# EAGLE design PCB_LTC6752 (EAGLE 9.1.2)
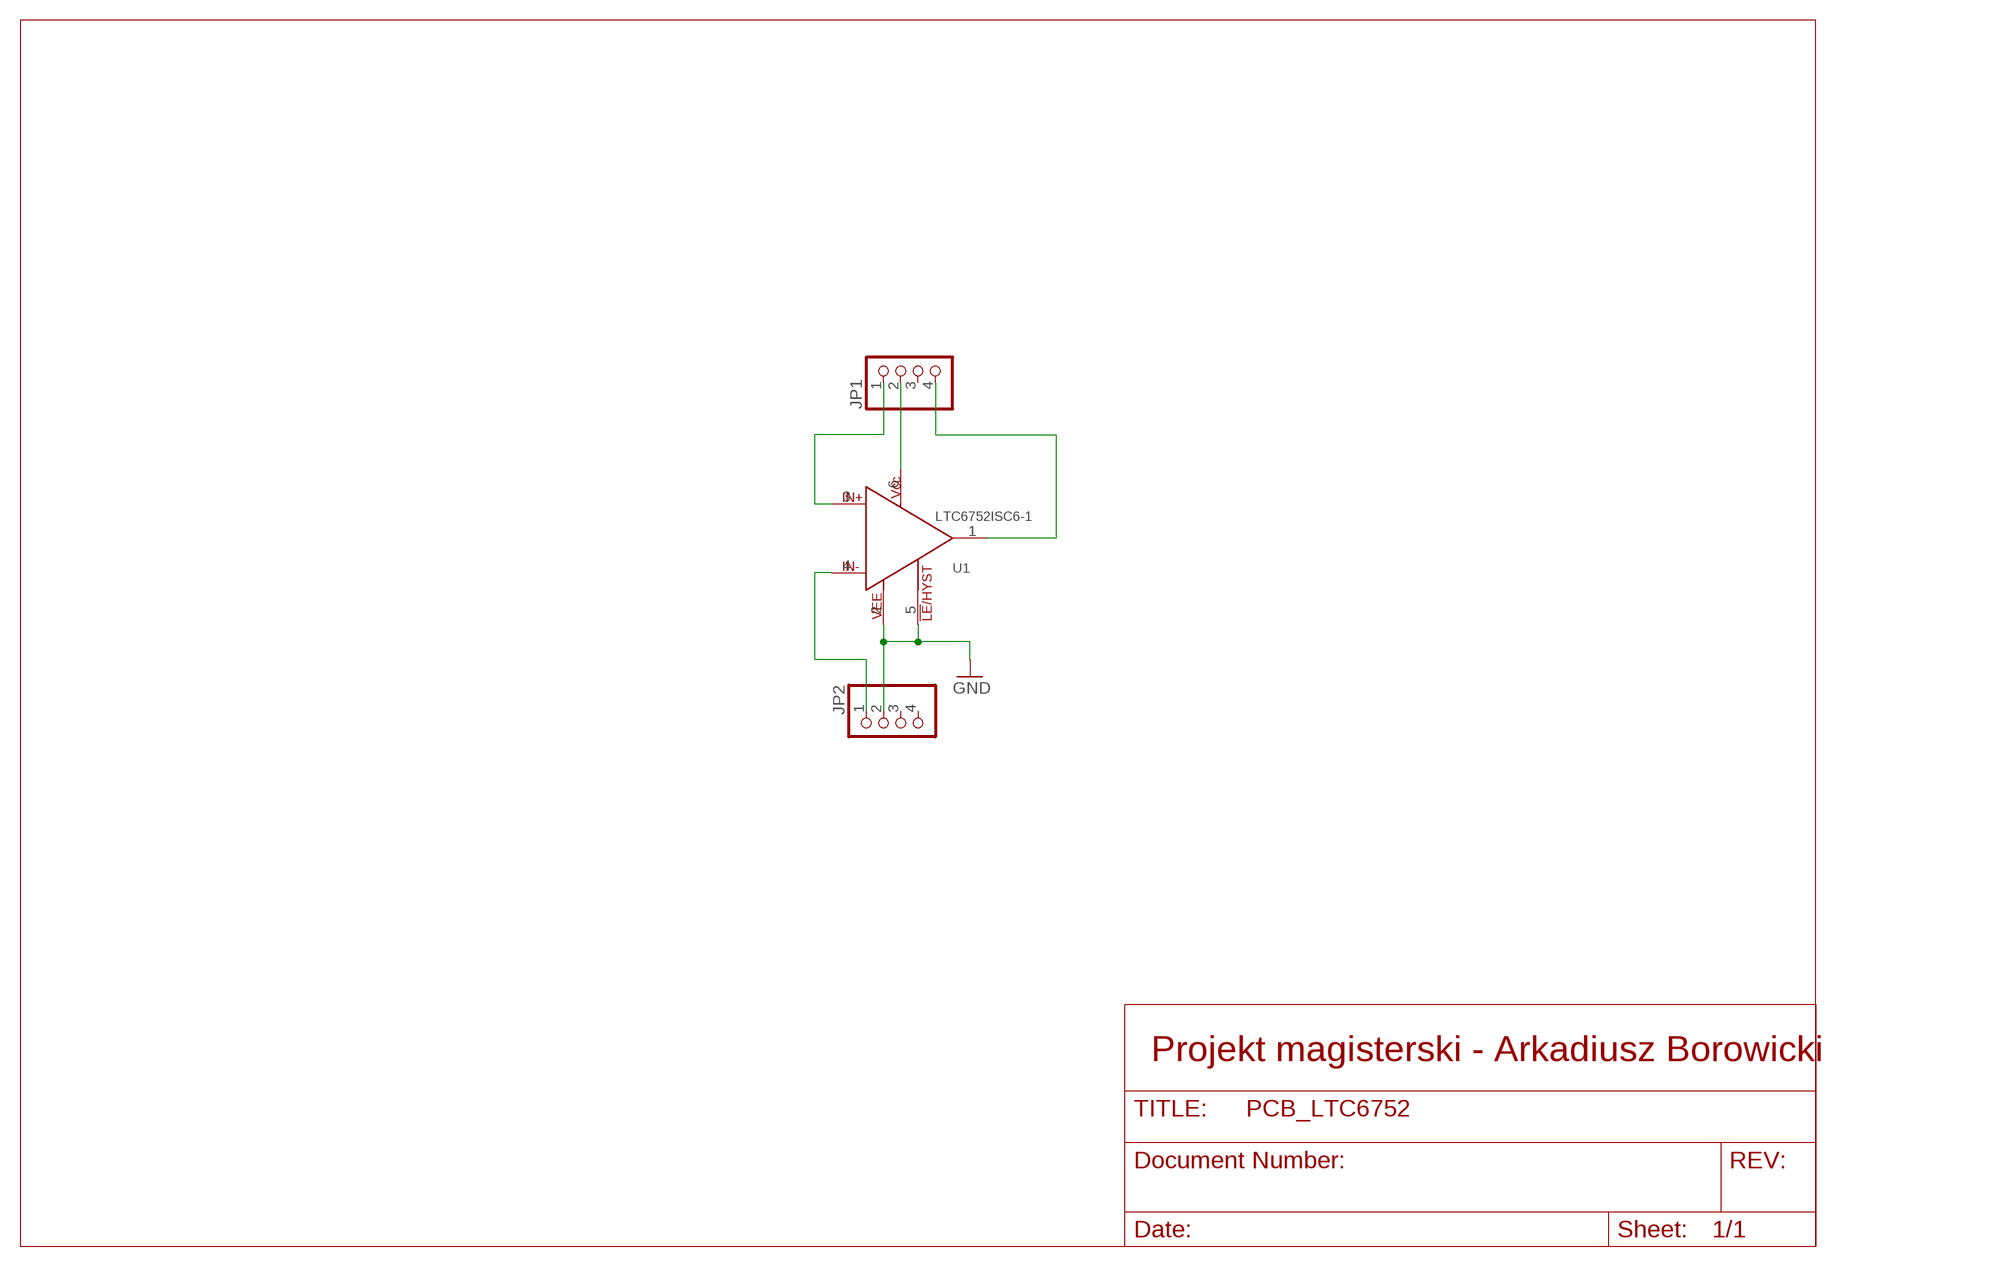
[diagram p0: schematic, sheet 1]

## Parts
JP1  PINHD-1X4  [1X04]
JP2  PINHD-1X4  [1X04]
U1  LTC6752ISC6-1  [SC70-6]

## Nets
GND: JP2.2 U1.2(VEE) U1.5(HYST)
N$1: JP1.2 U1.6(VCC)
N$2: JP1.1 U1.3(IN+)
N$3: JP2.1 U1.4(IN-)
N$5: JP1.4 U1.1(OUT)
Unconnected: JP1.3 JP2.3 JP2.4

## Notes on the sheet
- Projekt magisterski - Arkadiusz Borowicki

## Library data of the parts
JP1 JP2 = pinhead:PINHD-1X4: PIN HEADER
U1 = LTC6752ISC6-1:LTC6752ISC6-1: Check availability <https://pricing.snapeda.com/parts/LTC6752ISC6-1/Analog%20Devices%20Inc./view-part?ref=eda>; AVAILABILITY: In Stock; CHECK_PRICES: https://www.snapeda.com/parts/LTC6752ISC6-1/Analog+Devices/view-part/?ref=eda; DESCRIPTION: Comparator Single R-R I/P 3.5V 6-Pin SC-70 T/R; MF: Analog Devices Inc.; MP: LTC6752ISC6-1; PACKAGE: None; PRICE: None; SNAPEDA_LINK: https://www.snapeda.com/parts/LTC6752ISC6-1/Analog+Devices/view-part/?ref=snap

## Board
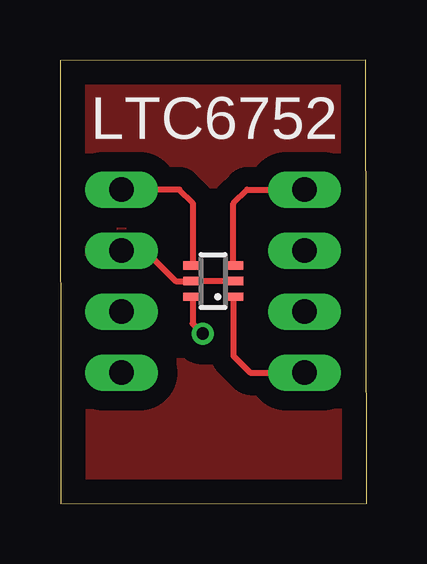
[diagram p1: board, top side]
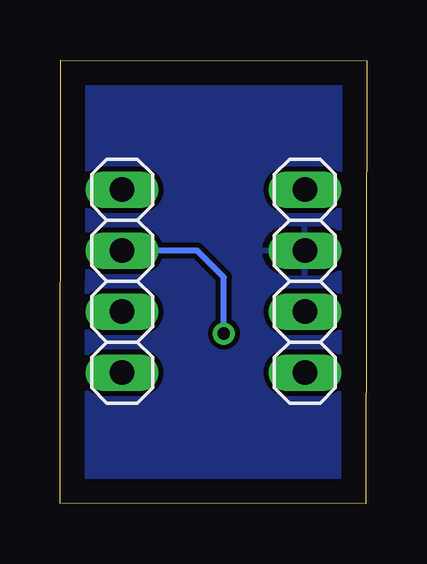
[diagram p2: board, bottom side, seen from below]

Size 12.77 x 18.48 mm. Coordinates in mm from the lower left corner, seen from the top.
Outline: 0.03,0 12.77,0.03 12.75,18.48 0,18.46 0.03,0
Copper layers (1*16): Top 0.035mm / dielectric 1.5mm / Bottom 0.035mm
Design rules "default *": minimum track width 10mil, minimum drill 20mil, track to track 8mil, track to pad 8mil, pad to pad 8mil, via to via 8mil, smd to smd 8mil, copper to edge 40mil, drill to drill 8mil, minimum pad ring 10mil, minimum via ring 8mil, stop-mask expansion 4mil, vias tented up to drill 25mil, thermal gap 10mil
tRestrict: area 2.4,10.3 to 4.4,10.6; area 4,11.2 to 4.5,11.7; area 3.9,9.4 to 4.1,9.8

### Footprints (pad centres in the part's own frame; a part is rotated, then mirrored left to right if it is on the bottom)
1X04 = drill 1.016 long: 1 -3.81,0; 2 -1.27,0; 3 1.27,0; 4 3.81,0
SC70-6 = smd 0.35 x 0.8: 1 -0.65,-0.85; 2 0,-0.85; 3 0.65,-0.85; 4 0.65,0.85; 5 0,0.85; 6 -0.65,0.85

### Placement (x,y rotation side)
JP1  10.19,9.27 270 bottom
JP2  2.57,9.27 270 bottom
U1  6.38,9.27 90 top

### Tracks (layer width: path | path; a pad name or v marks a point on that pad's centre or on a via)
GND
  Top 0.254: U1.2 U1.5 4.83,9.27 3.56,10.54 JP2.2
  pour Top (isolate 0.813): 0.05,18.67 13.16,18.67 13.16,-0.23 0.05,-0.23 0,18.67
  pour Bottom: -0.1,18.72 13.08,18.72 13.13,18.67 13.13,-0.2 0.05,-0.2 -0.08,-0.2 -0.08,18.69
N$1  (via drill 0.51)
  Top 0.254: U1.6 5.53,7.5 v5.94,7.09
  Bottom 0.254: v5.94,7.09 5.94,9.42 7.06,10.54 JP1.2
N$2
  Top 0.254: U1.3 7.23,12.51 7.8,13.08 JP1.1
N$3
  Top 0.254: U1.4 5.53,12.53 4.98,13.08 JP2.1
N$5
  Top 0.254: U1.1 7.23,6.16 7.92,5.46 JP1.4

### Text on the board
tNames: LTC6752